# EAGLE design WMD_Board (EAGLE 9.3.0)

## Sheet 1 of 3: Power System
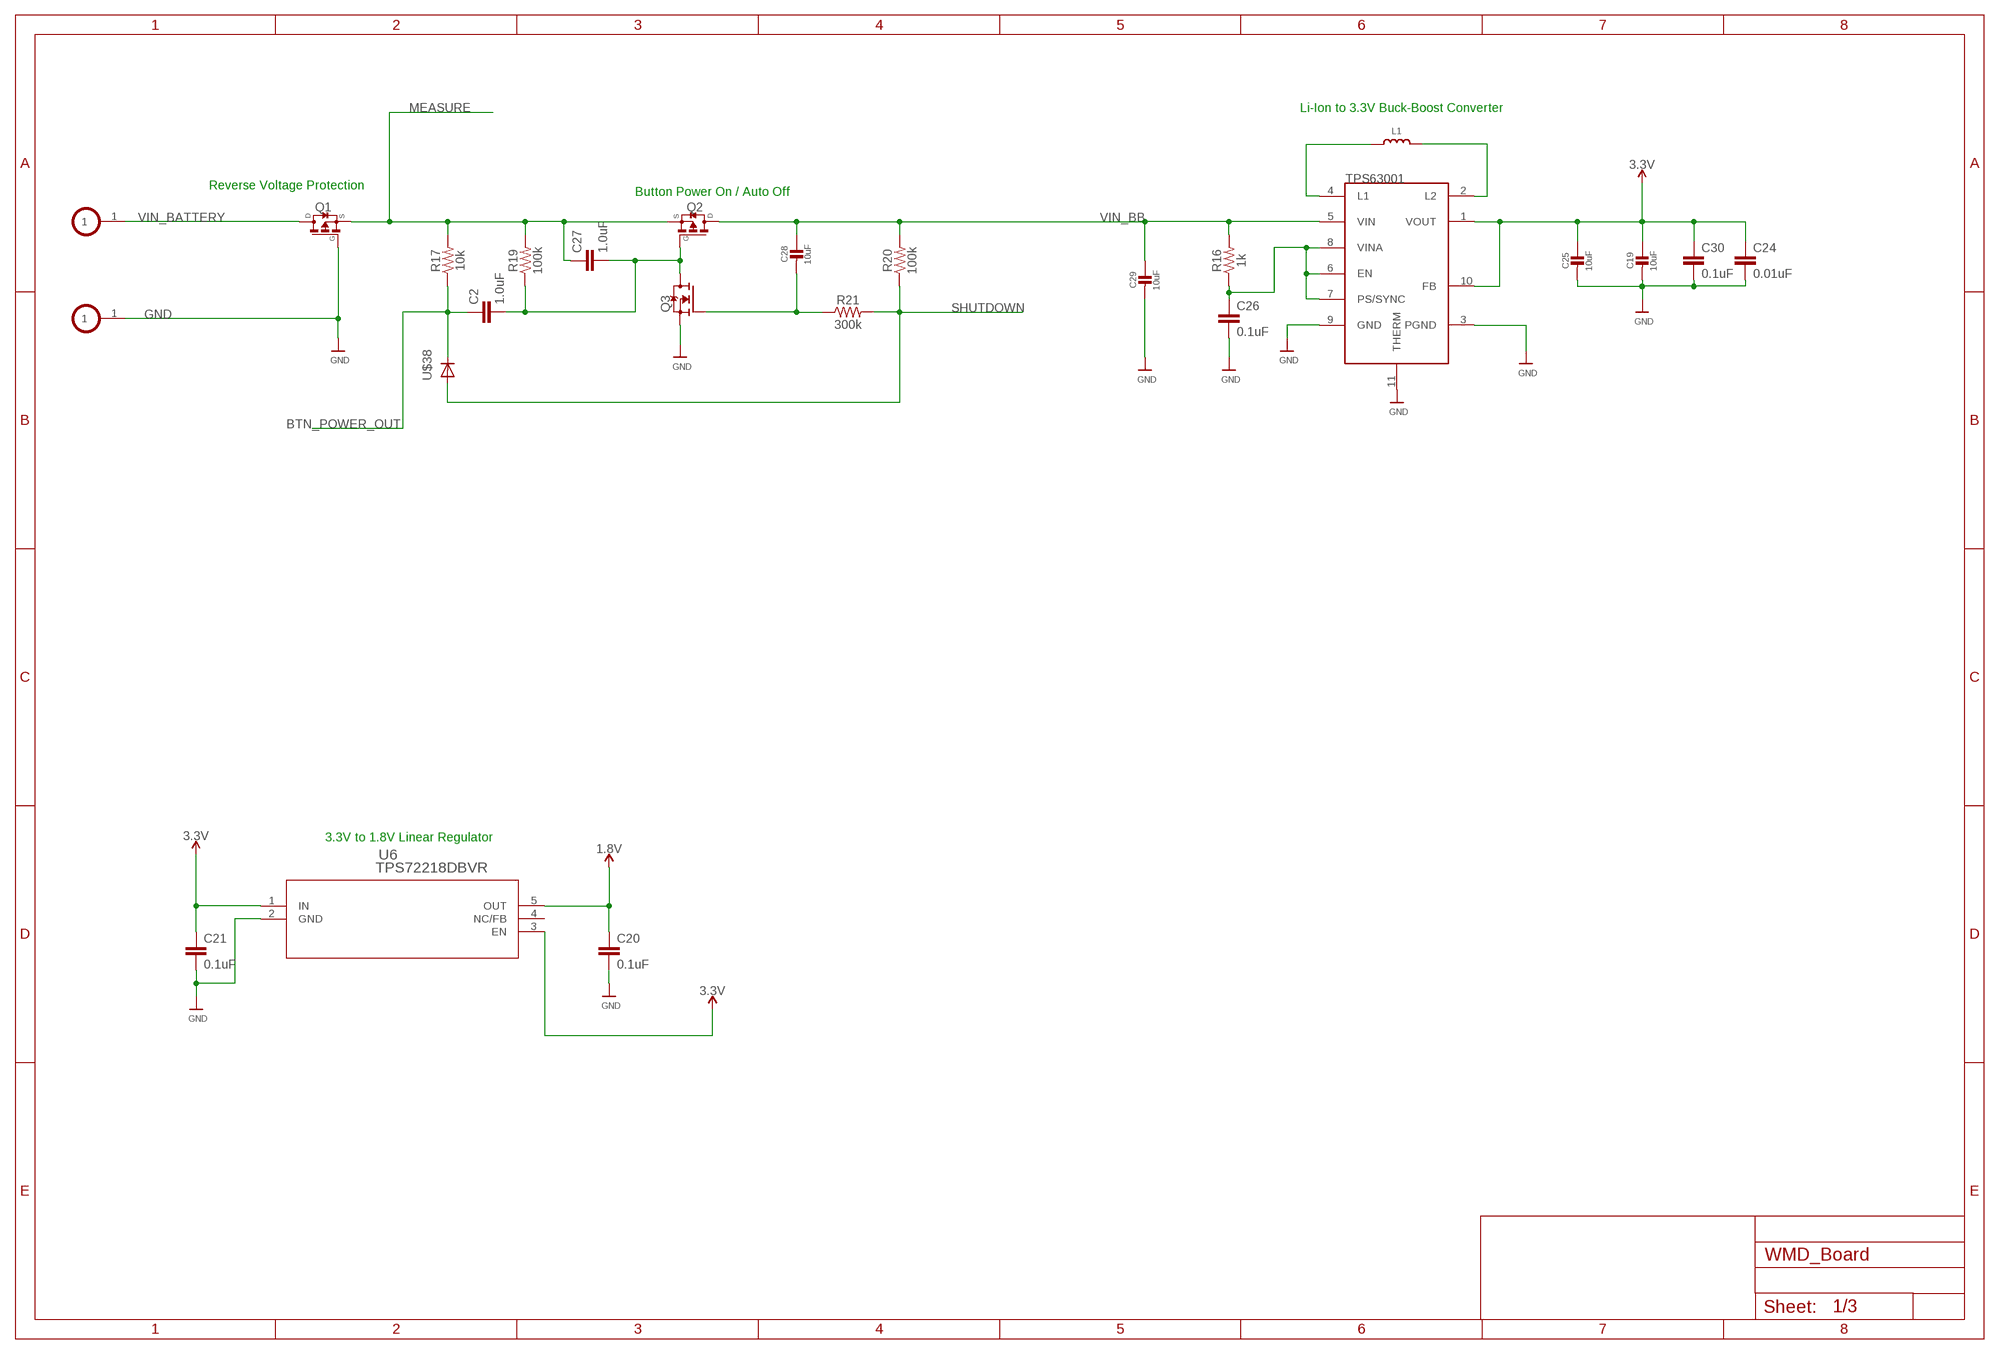
[diagram p0: schematic, sheet 1]

### Parts
C2  1.0uF  1.0UF-0603-16V-10%  [0603]
C19  10uF  CAP_CERAMIC0805-NOOUTLINE  [0805-NO]
C20  0.1uF  0.1UF-0603-25V-(+80/-20%)  [0603]
C21  0.1uF  0.1UF-0603-25V-(+80/-20%)  [0603]
C24  0.01uF  1.0UF-0603-16V-10%  [0603]
C25  10uF  CAP_CERAMIC0805-NOOUTLINE  [0805-NO]
C26  0.1uF  1.0UF-0603-16V-10%  [0603]
C27  1.0uF  1.0UF-0603-16V-10%  [0603]
C28  10uF  CAP_CERAMIC0805-NOOUTLINE  [0805-NO]
C29  10uF  CAP_CERAMIC0805-NOOUTLINE  [0805-NO]
C30  0.1uF  1.0UF-0603-16V-10%  [0603]
L1  2.2uH/NRH2412T2R2MNGH  INDUCTORNRH2412T  [INDUCTOR_TAIYOYUDEN_NRH2412T]
Q1  SI2323DS-T1-E3  [SOT23]
Q2  SI2323DS-T1-E3  [SOT23]
Q3  SI2312BDS  [SOT23]
R16  1k  1KOHM-0603-1/10W-1%  [0603]
R17  10k  1KOHM-0603-1/10W-1%  [0603]
R19  100k  1KOHM-0603-1/10W-1%  [0603]
R20  100k  1KOHM-0603-1/10W-1%  [0603]
R21  300k  1KOHM-0603-1/10W-1%  [0603]
U6  TPS72218DBVR  [DBV5]
U$22  TPS63001  [TPS63001]
U$38  TS4148C_RZG  [C0805K]
U$40  BATTERY_HOLE  [BATTERY_HOLE]
U$41  BATTERY_HOLE  [BATTERY_HOLE]

### Nets
1.8V: C20.1 U6.5(OUT) ; also sheet 2,3
3.3V: C19.1 C21.1 C24.1 C25.1 C30.1 U6.1(IN) U6.3(EN) U$22.1(VOUT) U$22.10(FB) ; also sheet 2,3
BTN_POWER_OUT: C2.1 R17.1 U$38.C ; also sheet 2
GND: C19.2 C20.2 C21.2 C24.2 C25.2 C26.2 C29.2 C30.2 Q1.1(G) Q3.2(S) U6.2(GND) U$22.3(PGND) U$22.9(GND) U$22.11(THERM) U$41.1 ; also sheet 2,3
MEASURE: C27.1 Q1.2(S) Q2.2(S) R17.2 R19.2 ; also sheet 2
N$2: L1.1 U$22.4(L1)
N$3: L1.2 U$22.2(L2)
N$7: C26.1 R16.1 U$22.6(EN) U$22.7(PS/SYNC) U$22.8(VINA)
N$13: C28.2 Q3.1(G) R21.1
N$14: C2.2 C27.2 Q2.1(G) Q3.3(D) R19.1
SHUTDOWN: R20.1 R21.2 U$38.A ; also sheet 2
VIN_BATTERY: Q1.3(D) U$40.1
VIN_BB: C28.1 C29.1 Q2.3(D) R16.2 R20.2 U$22.5(VIN)
Unconnected: U6.4(NC/FB)

### Notes on the sheet
- Li-Ion to 3.3V Buck-Boost Converter
- Reverse Voltage Protection
- Button Power On / Auto Off
- 3.3V to 1.8V Linear Regulator

## Sheet 2 of 3: Microcontroller
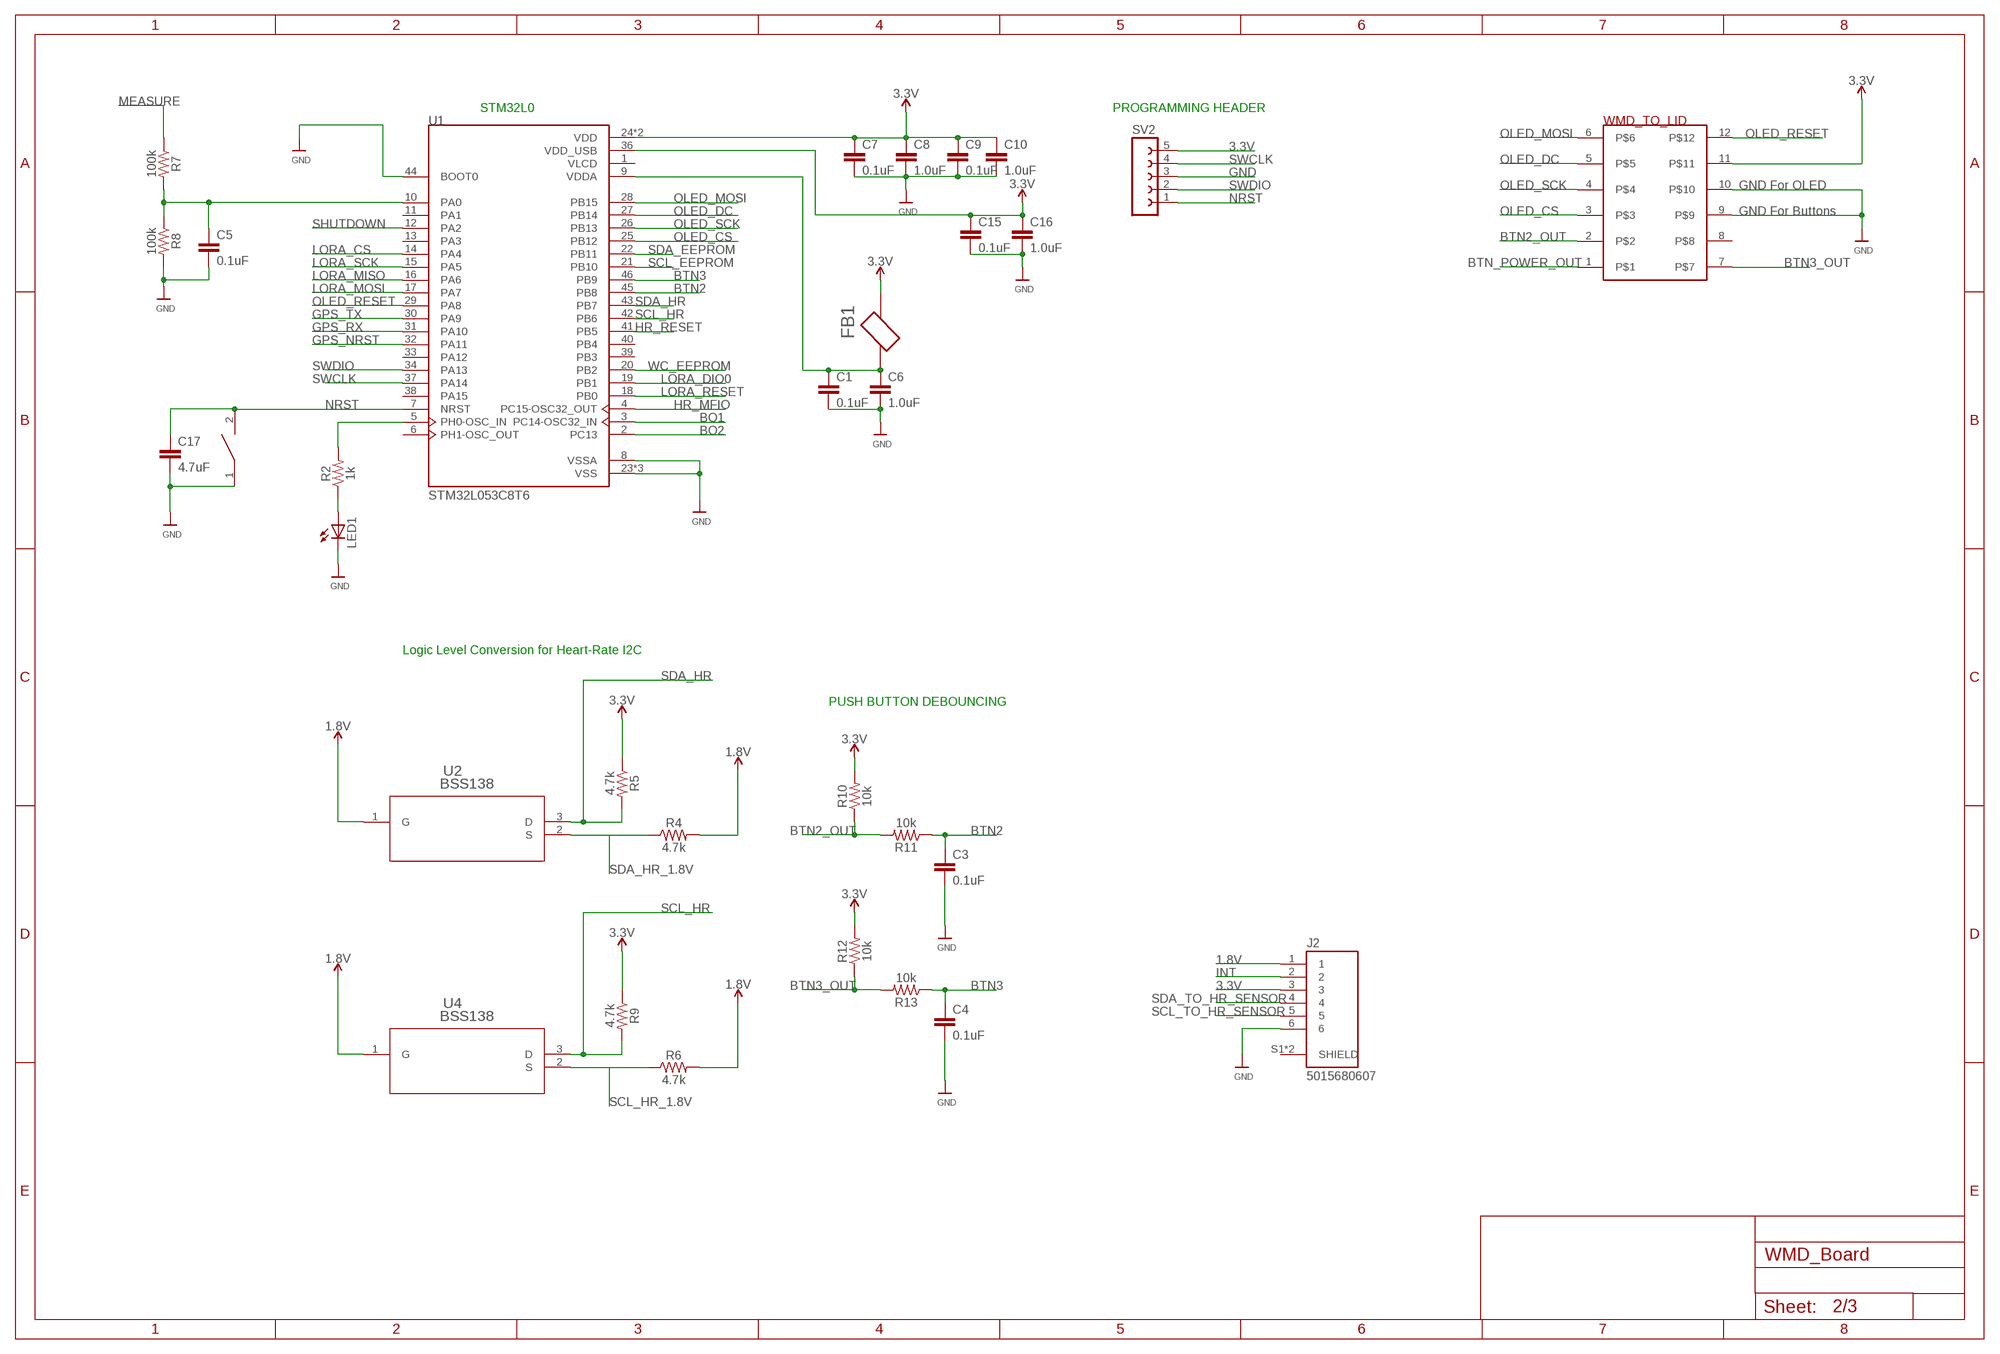
[diagram p1: schematic, sheet 2]

### Parts
C1  0.1uF  0.1UF-0603-25V-(+80/-20%)  [0603]
C3  0.1uF  0.1UF-0603-25V-(+80/-20%)  [0603]
C4  0.1uF  0.1UF-0603-25V-(+80/-20%)  [0603]
C5  0.1uF  0.1UF-0603-25V-(+80/-20%)  [0603]
C6  1.0uF  1.0UF-0603-16V-10%  [0603]
C7  0.1uF  0.1UF-0603-25V-(+80/-20%)  [0603]
C8  1.0uF  1.0UF-0603-16V-10%  [0603]
C9  0.1uF  0.1UF-0603-25V-(+80/-20%)  [0603]
C10  1.0uF  1.0UF-0603-16V-10%  [0603]
C15  0.1uF  0.1UF-0603-25V-(+80/-20%)  [0603]
C16  1.0uF  1.0UF-0603-16V-10%  [0603]
C17  4.7uF  4.7UF0603  [0603]
FB1  FERRITE_BEAD  [BEADC1608X100N]
J2  5015680607  [MOLEX_5015680607]
LED1  LEDCHIP-LED0805  [CHIP-LED0805]
R2  1k  1KOHM-0603-1/10W-1%  [0603]
R4  4.7k  1KOHM-0603-1/10W-1%  [0603]
R5  4.7k  1KOHM-0603-1/10W-1%  [0603]
R6  4.7k  1KOHM-0603-1/10W-1%  [0603]
R7  100k  1KOHM-0603-1/10W-1%  [0603]
R8  100k  1KOHM-0603-1/10W-1%  [0603]
R9  4.7k  1KOHM-0603-1/10W-1%  [0603]
R10  10k  10KOHM-0603-1/10W-1%  [0603]
R11  10k  10KOHM-0603-1/10W-1%  [0603]
R12  10k  10KOHM-0603-1/10W-1%  [0603]
R13  10k  10KOHM-0603-1/10W-1%  [0603]
RESET  SWITCH  [SW_2512]
SV2  FE05-1  [FE05-1]
U1  STM32L053C8T6  [QFP50P900X900X160-48N]
U2  BSS138  [SOT-23-3L]
U4  BSS138  [SOT-23-3L]
U$20  TS_DR_6  [TST_DR_6]

### Nets
1.8V: J2.1 R4.2 R6.2 U2.1(G) U4.1(G) ; also sheet 1,3
3.3V: C7.1 C8.1 C9.1 C10.1 C15.1 C16.1 FB1.1 J2.3 R5.1 R9.1 R10.2 R12.2 SV2.5 U1.24(VDD) U1.36(VDD_USB) U1.48(VDD) U$20.11 ; also sheet 1,3
BO1: U1.3(PC14-OSC32_IN)
BO2: U1.2(PC13)
BTN2: C3.1 R11.1 U1.45(PB8)
BTN2_OUT: R10.1 R11.2 U$20.2
BTN3: C4.1 R13.1 U1.46(PB9)
BTN3_OUT: R12.1 R13.2 U$20.7
BTN_POWER_OUT: U$20.1 ; also sheet 1
GND: C1.2 C3.2 C4.2 C5.2 C6.2 C7.2 C8.2 C9.2 C10.2 C15.2 C16.2 C17.2 J2.6 LED1.C R8.2 RESET.1 SV2.3 U1.8(VSSA) U1.23(VSS) U1.35(VSS) U1.44(BOOT0) U1.47(VSS) U$20.9 U$20.10 ; also sheet 1,3
GPS_NRST: U1.32(PA11) ; also sheet 3
GPS_RX: U1.31(PA10) ; also sheet 3
GPS_TX: U1.30(PA9) ; also sheet 3
HR_MFIO: U1.4(PC15-OSC32_OUT) ; also sheet 3
HR_RESET: U1.41(PB5) ; also sheet 3
INT: J2.2 ; also sheet 3
LORA_CS: U1.14(PA4) ; also sheet 3
LORA_DIO0: U1.19(PB1) ; also sheet 3
LORA_MISO: U1.16(PA6) ; also sheet 3
LORA_MOSI: U1.17(PA7) ; also sheet 3
LORA_RESET: U1.18(PB0) ; also sheet 3
LORA_SCK: U1.15(PA5) ; also sheet 3
MEASURE: R7.1 ; also sheet 1
N$1: LED1.A R2.1
N$4: C5.1 R7.2 R8.1 U1.10(PA0)
N$5: C1.1 C6.1 FB1.2 U1.9(VDDA)
N$12: R2.2 U1.5(PH0-OSC_IN)
NRST: C17.1 RESET.2 SV2.1 U1.7(NRST)
OLED_CS: U1.25(PB12) U$20.3
OLED_DC: U1.27(PB14) U$20.5
OLED_MOSI: U1.28(PB15) U$20.6
OLED_RESET: U1.29(PA8) U$20.12
OLED_SCK: U1.26(PB13) U$20.4
SCL_EEPROM: U1.21(PB10) ; also sheet 3
SCL_HR: R9.2 U1.42(PB6) U4.3(D)
SCL_HR_1.8V: R6.1 U4.2(S) ; also sheet 3
SCL_TO_HR_SENSOR: J2.5 ; also sheet 3
SDA_EEPROM: U1.22(PB11) ; also sheet 3
SDA_HR: R5.2 U1.43(PB7) U2.3(D)
SDA_HR_1.8V: R4.1 U2.2(S) ; also sheet 3
SDA_TO_HR_SENSOR: J2.4 ; also sheet 3
SHUTDOWN: U1.12(PA2) ; also sheet 1
SWCLK: SV2.4 U1.37(PA14)
SWDIO: SV2.2 U1.34(PA13)
WC_EEPROM: U1.20(PB2) ; also sheet 3
Unconnected: J2.S1(SHIELD) J2.S2(SHIELD) U1.1(VLCD) U1.6(PH1-OSC_OUT) U1.11(PA1) U1.13(PA3) U1.33(PA12) U1.38(PA15) U1.39(PB3) U1.40(PB4) U$20.8

### Notes on the sheet
- STM32L0 | PROGRAMMING HEADER
- GND For OLED
- GND For Buttons
- Logic Level Conversion for Heart-Rate I2C
- PUSH BUTTON DEBOUNCING

## Sheet 3 of 3: Sensors
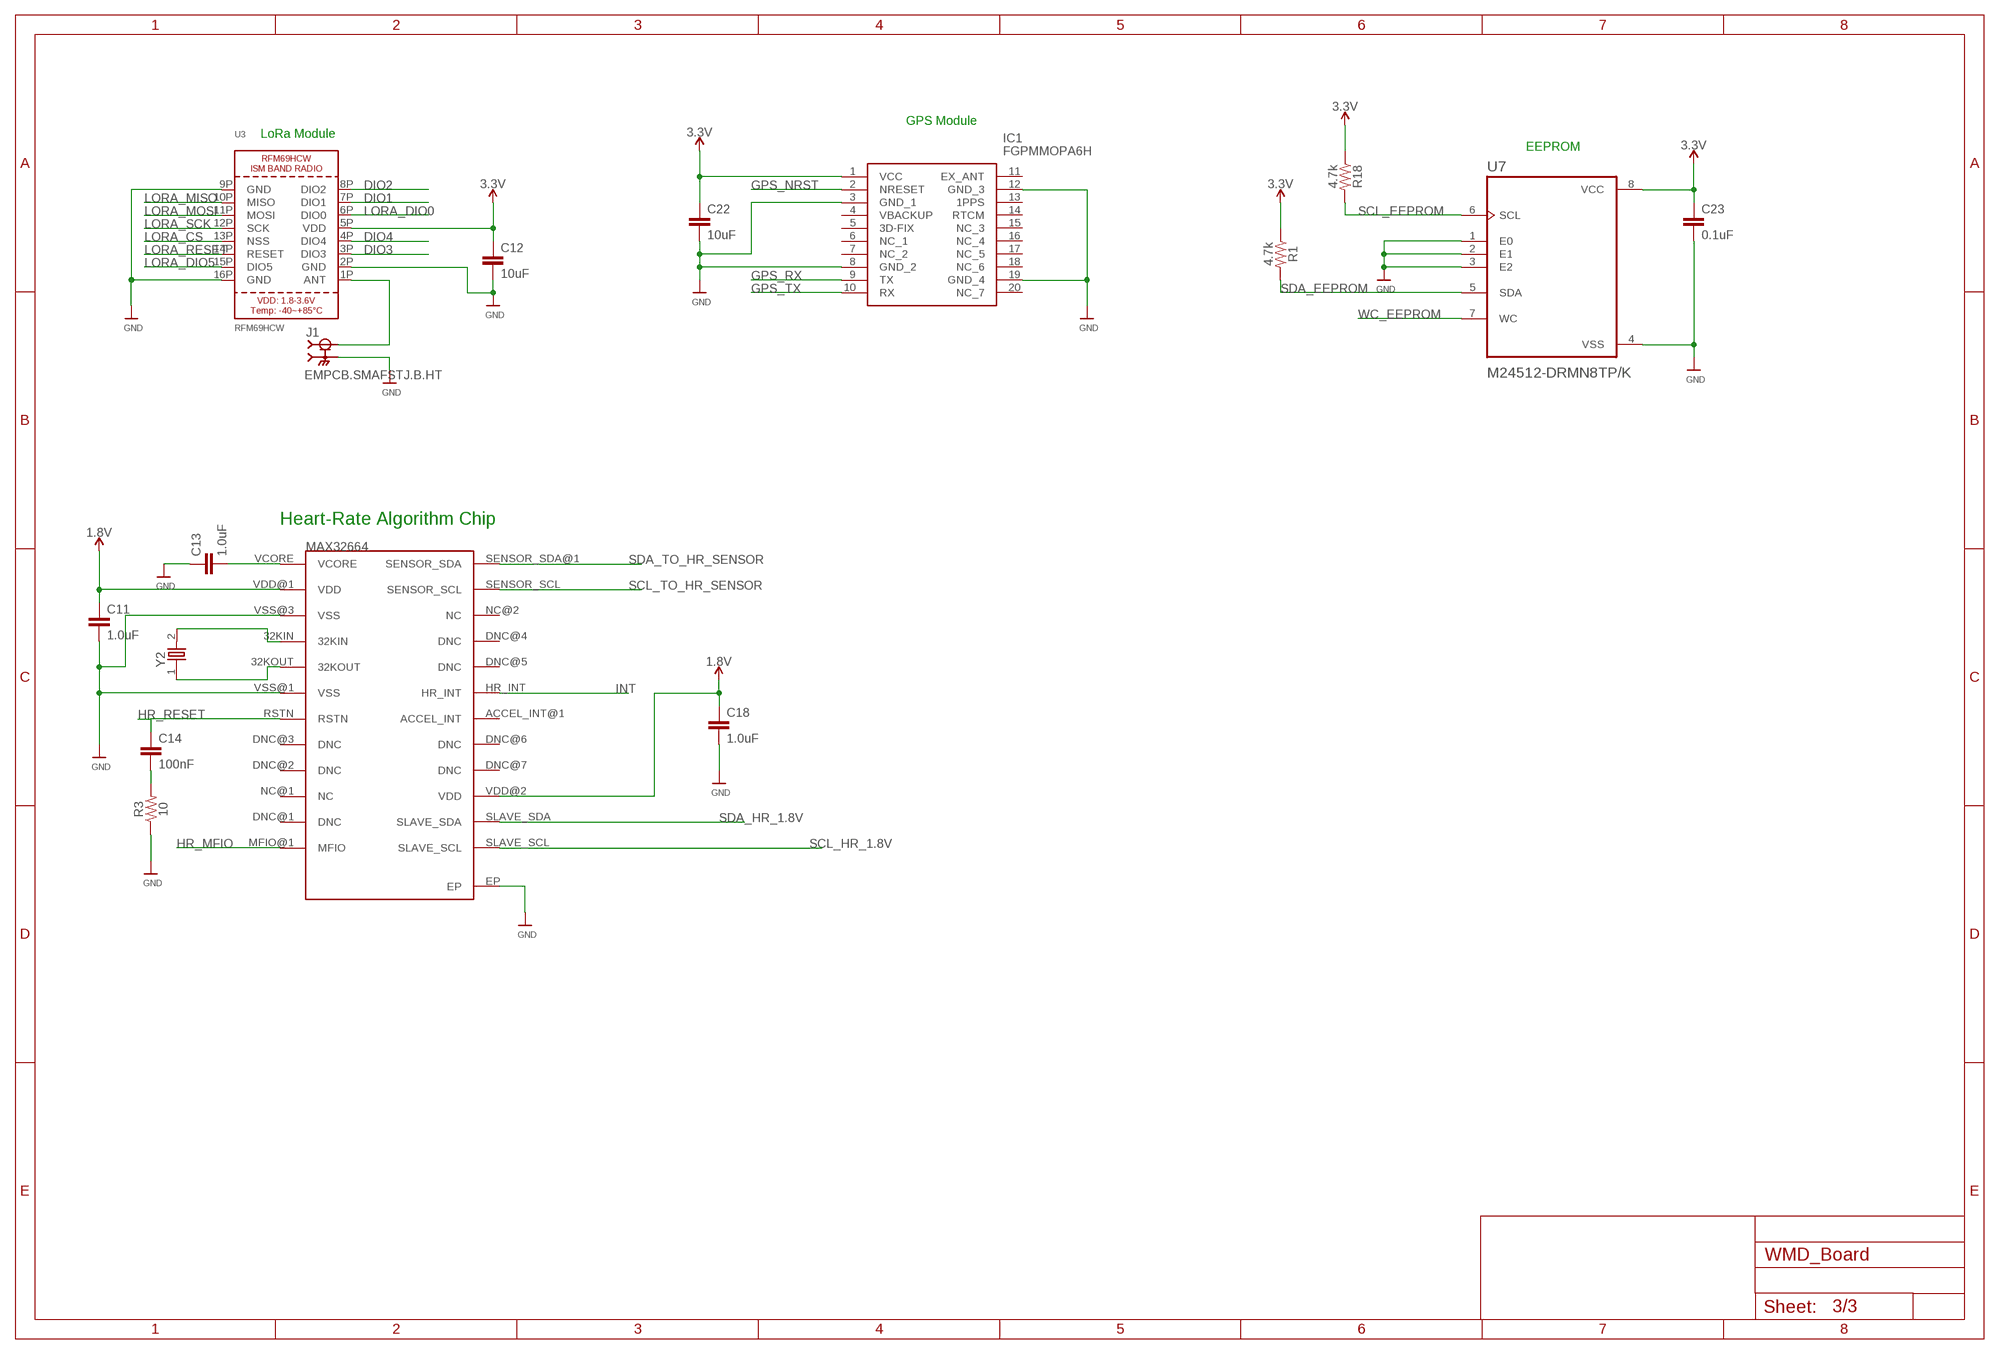
[diagram p2: schematic, sheet 3]

### Parts
C11  1.0uF  1.0UF-0603-16V-10%  [0603]
C12  10uF  10UF-0603-6.3V-20%  [0603]
C13  1.0uF  1.0UF-0603-16V-10%  [0603]
C14  100nF  1.0UF-0603-16V-10%  [0603]
C18  1.0uF  1.0UF-0603-16V-10%  [0603]
C22  10uF  10UF-0603-6.3V-20%  [0603]
C23  0.1uF  0.1UF-0603-25V-(+80/-20%)  [0603]
IC1  FGPMMOPA6H  [FGPMMOPA6H]
J1  EMPCB.SMAFSTJ.B.HT  [TAOGLAS_EMPCB.SMAFSTJ.B.HT]
R1  4.7k  1KOHM-0603-1/10W-1%  [0603]
R3  10  100KOHM-0603-1/10W-1%  [0603]
R18  4.7k  1KOHM-0603-1/10W-1%  [0603]
U3  RFM69HCW  RFM69HCW_SMT  [RFMHCW_SMT]
U7  M24512-DRMN8TP/K  [SOIC127P600X175-8N]
U$10  MAX32664_TQFN  [MAX32664]
Y2  ABS06-107-32.768KHZ-T  [XTAL_ABS06-107-32.768KHZ-T]

### Nets
1.8V: C11.1 C18.1 U$10.VDD@1(VDD) U$10.VDD@2(VDD) ; also sheet 1,2
3.3V: C12.1 C22.1 C23.1 IC1.1(VCC) R1.1 R18.1 U3.5P(VDD) U7.8(VCC) ; also sheet 1,2
DIO1: U3.7P(DIO1)
DIO2: U3.8P(DIO2)
DIO3: U3.3P(DIO3)
DIO4: U3.4P(DIO4)
GND: C11.2 C12.2 C13.1 C18.2 C22.2 C23.2 IC1.3(GND_1) IC1.8(GND_2) IC1.12(GND_3) IC1.19(GND_4) J1.SH1 J1.SH2 J1.SH3 J1.SH4 R3.1 U3.2P(GND) U3.9P(GND) U3.16P(GND) U7.1(E0) U7.2(E1) U7.3(E2) U7.4(VSS) U$10.EP U$10.VSS@1(VSS) U$10.VSS@3(VSS) ; also sheet 1,2
GPS_NRST: IC1.2(NRESET) ; also sheet 2
GPS_RX: IC1.9(TX) ; also sheet 2
GPS_TX: IC1.10(RX) ; also sheet 2
HR_MFIO: U$10.MFIO@1(MFIO) ; also sheet 2
HR_RESET: C14.1 U$10.RSTN ; also sheet 2
INT: U$10.HR_INT ; also sheet 2
LORA_CS: U3.13P(NSS) ; also sheet 2
LORA_DIO0: U3.6P(DIO0) ; also sheet 2
LORA_DIO5: U3.15P(DIO5)
LORA_MISO: U3.10P(MISO) ; also sheet 2
LORA_MOSI: U3.11P(MOSI) ; also sheet 2
LORA_RESET: U3.14P(RESET) ; also sheet 2
LORA_SCK: U3.12P(SCK) ; also sheet 2
N$6: C13.2 U$10.VCORE
N$8: J1.1 U3.1P(ANT)
N$9: C14.2 R3.2
N$10: U$10.32KIN Y2.2
N$11: U$10.32KOUT Y2.1
SCL_EEPROM: R18.2 U7.6(SCL) ; also sheet 2
SCL_HR_1.8V: U$10.SLAVE_SCL ; also sheet 2
SCL_TO_HR_SENSOR: U$10.SENSOR_SCL ; also sheet 2
SDA_EEPROM: R1.2 U7.5(SDA) ; also sheet 2
SDA_HR_1.8V: U$10.SLAVE_SDA ; also sheet 2
SDA_TO_HR_SENSOR: U$10.SENSOR_SDA@1(SENSOR_SDA) ; also sheet 2
WC_EEPROM: U7.7(WC) ; also sheet 2
Unconnected: IC1.4(VBACKUP) IC1.5(3D-FIX) IC1.6(NC_1) IC1.7(NC_2) IC1.11(EX_ANT) IC1.13(1PPS) IC1.14(RTCM) IC1.15(NC_3) IC1.16(NC_4) IC1.17(NC_5) IC1.18(NC_6) IC1.20(NC_7) U$10.ACCEL_INT@1(ACCEL_INT) U$10.DNC@1(DNC) U$10.DNC@2(DNC) U$10.DNC@3(DNC) U$10.DNC@4(DNC) U$10.DNC@5(DNC) U$10.DNC@6(DNC) U$10.DNC@7(DNC) U$10.NC@1(NC) U$10.NC@2(NC)

### Notes on the sheet
- GPS Module
- LoRa Module
- EEPROM
- Heart-Rate Algorithm Chip

## Library data of the parts
C1 C3-C5 C7 C9 C15 C20 C21 C23 = SparkFun-Capacitors:0.1UF: 0.1µF ceramic capacitors A capacitor is a passive two-terminal electrical component used to store electrical energy temporarily in an electric field.; PROD_ID: CAP-00810
C2 C6 C8 C10 C11 C13 C16 C18 C27 = SparkFun-Capacitors:1.0UF: 1µF ceramic capacitors A capacitor is a passive two-terminal electrical component used to store electrical energy temporarily in an electric field.; PROD_ID: CAP-00868
C12 C22 = SparkFun-Capacitors:10UF: 10.0µF ceramic capacitors A capacitor is a passive two-terminal electrical component used to store electrical energy temporarily in an electric field.; PROD_ID: CAP-11015
C14 C24 C26 C30 = SparkFun-Capacitors:1.0UF: 1µF ceramic capacitors A capacitor is a passive two-terminal electrical component used to store electrical energy temporarily in an electric field.; PROD_ID: CAP-00868; VALUE: 1.0uF
C17 = SparkFun-Capacitors:4.7UF: 4.7µF ceramic capacitors A capacitor is a passive two-terminal electrical component used to store electrical energy temporarily in an electric field.; PROD_ID: CAP-08280
C19 C25 C28 C29 = microbuilder:CAP_CERAMIC: Ceramic Capacitors For new designs, use the packages preceded by an '_' character since they are more reliable: The following footprints should be used on most boards: _0402 - Standard footprint for regular board layouts _0603 - Standard footprint for regular board layouts _0805 - Standard footprint for regular board layouts _1206 - Standard footprint for regular board layouts For extremely tight-pitch boards where space is at a premium, the following 'micro-pitch' footprints can be used (smaller pads, no silkscreen outline, etc.): _0402MP - Micro-pitch footprint for very dense/compact boards _0603MP - Micro-pitch footprint for very dense/compact boards _0805MP - Micro-pitch footprint for very dense/compact boards _1206MP - Micro-pitch footprint for very dense/compact boards
FB1 = Ferrite_Bead:FERRITE_BEAD: Ferrite Beads Power Chip 18Ohm 30% 100MHz 7.5A 4mOhm DCR 0603 Automotive T/R; DESCRIPTION: 18 Ohms @ 100MHz 1 Power Line Ferrite Bead 0603 _1608 Metric_ 7.5A 4mOhm; DIGI-KEY_PART_NUMBER: 587-3251-1-ND; DIGI-KEY_PURCHASE_URL: https://www.digikey.com/product-detail/en/abb-power-electronics-inc-va/FBMJ1608HM180NTR/587-3251-1-ND/3662204?utm_source=snapeda&utm_medium=aggregator&utm_campaign=symbol; MF: Taiyo Yuden; MP: FBMJ1608HM180NTR; PACKAGE: 1608 Taiyo Yuden
IC1 = FGPMMOPA6H:FGPMMOPA6H: GPS Standalone Module, 20-pin Source: Datasheet <https://cdn-shop.adafruit.com/datasheets/GlobalTop-FGPMMOPA6H-Datasheet-V0A.pdf>; DESCRIPTION: GPS Standalone Module, 20-pin; HEIGHT: mm; MANUFACTURER_NAME: GlobalTop Technology Inc.; MANUFACTURER_PART_NUMBER: FGPMMOPA6H
J1 = EMPCB.SMAFSTJ.B.HT:EMPCB.SMAFSTJ.B.HT: Conn SMA F 0Hz to 12.4GHz 50Ohm Solder ST Edge Mount Gold; DESCRIPTION: SMA Connector Jack, Female Socket 50Ohm Board Edge, End Launch Solder; DIGI-KEY_PART_NUMBER: 931-1175-ND; DIGI-KEY_PURCHASE_URL: https://www.digikey.com/product-detail/en/taoglas-limited/EMPCB.SMAFSTJ.B.HT/931-1175-ND/3522337?utm_source=snapeda&utm_medium=aggregator&utm_campaign=symbol; MF: Taoglas Limited; MP: EMPCB.SMAFSTJ.B.HT; PACKAGE: None
J2 = WMD_TO_HRF:5015680607: 1.00mm Pitch Pico-Clasp™ Wire-to-Board Header, Surface Mount, Single Row, Right Angle, with Positive Lock, 6 Circuits; DESCRIPTION: Connector Header Surface Mount, Right Angle 6 position 0.039 _1.00mm_; DIGI-KEY_PART_NUMBER: WM7897CT-ND; DIGI-KEY_PURCHASE_URL: https://www.digikey.com/product-detail/en/molex/5015680607/WM7897CT-ND/1531547?utm_source=snapeda&utm_medium=aggregator&utm_campaign=symbol; MF: Molex; MP: 5015680607; PACKAGE: None
L1 = microbuilder:INDUCTOR: Inductors 0603: 10nH Ceramic Inductor - microwire antenna/RF (Digikey: 712-1434-2-ND) 0805: 560nH Ceramic Inductor - RF (Digikey: 553-1047-1-ND) 270nH Ceramic Inductor - Q = 40@250MHz, +-5%, 1 Ohm DC Resistance (Digikey: 535-10506-2-ND) 1007 (2518 Metric) SMT: 10µH 10% 250mOhm 820mA 1007 Inductor (Digikey: 587-2189-1-ND) 22µH 10% 500mOhm 580mA 1007 Inductor (Digikey: 587-2190-1-ND) 47µH 10% 950mOhm 420mA 1007 Inductor (Digikey: 587-2191-1-ND) 47µH 5% 100mOhm 1A 1008 Inductor (Digikey: 732-1816-1-ND) 5.0x5.0mm (Taiyo Yuden NR5040 Series) 6.8µH 20% 2.3A 64mOhm Inductor (Digikey: 587-2374-2-ND) 5.0x5.0mm (TDK VLC5045 Series) 4.7µH 20% 3.3A 34mOhm Inductor (Digikey: 445-6526-1-ND) 6.8µH 20% 2.7A 46mOhm Inductor (Digikey: 445-6527-1-ND) 6.0x6.0mm (TDK VLC6045 Series) 4.7µH 20% 3.8A 27mOhm Inductor (Digikey: 445-6538-2-ND) 6.8µH 20% 3A 41mOhm Inductor (Digikey: 445-6540-1-ND) 6.2µH 30% 2.2A 45mOhm Inductor (Digikey: SRR5028-6R2YCT-ND) - Not TDK VLC6045 but footprint should match 6.0x6.0mm (TDK SLF6045 Series) 6.8uH 30% 2A 33mOhm Inductor (Digikey: 445-4572-1-ND, Mouser: 810-SLF645T6R8N2R0PF) 6.0x6.0mm (Sumida CDRH5D28 Series) 6.2uH 30% 1.8A 45mOhm Inductor (Digikey: 308-1542-1-ND) Taiyo Yuden NR3015T2R2M - 2.2uH 20% 1.5A (Digikey: 587-1648-2-ND, Mouser: 963-NR3015T2R2M) - Used with TI TPS62172 CoilCraft RFID Transponder Coil - MA5532-AE (For use with AS3935 Lightning Sensor) Taiyo Yuden NRH2412T2R2MNGH - 2.2uH 20% 1AA (Digikey: 587-3443-1-ND) - Used with TI LM3671 Vishay IHLP 1.0uH Molded Inductor - 24mOhm DCR, 5A, +/-20%, -55°C-125°C (Digikey: 541-1319-1-ND)
LED1 = led:LED: LED OSRAM: - CHIPLED LG R971, LG N971, LY N971, LG Q971, LY Q971, LO R971, LY R971 LH N974, LH R974 LS Q976, LO Q976, LY Q976 LO Q996 - Hyper CHIPLED LW Q18S LB Q993, LB Q99A, LB R99A - SideLED LS A670, LO A670, LY A670, LG A670, LP A670 LB A673, LV A673, LT A673, LW A673 LH A674 LY A675 LS A676, LA A676, LO A676, LY A676, LW A676 LS A679, LY A679, LG A679 - Hyper Micro SIDELED® LS Y876, LA Y876, LO Y876, LY Y876 LT Y87S - SmartLED LW L88C, LW L88S LB L89C, LB L89S, LG L890 LS L89K, LO L89K, LY L89K LS L896, LA L896, LO L896, LY L896 - TOPLED LS T670, LO T670, LY T670, LG T670, LP T670 LSG T670, LSP T670, LSY T670, LOP T670, LYG T670 LG T671, LOG T671, LSG T671 LB T673, LV T673, LT T673, LW T673 LH T674 LS T676, LA T676, LO T676, LY T676, LB T676, LH T676, LSB T676, LW T676 LB T67C, LV T67C, LT T67C, LS T67K, LO T67K, LY T67K, LW E67C LS E67B, LA E67B, LO E67B, LY E67B, LB E67C, LV E67C, LT E67C LW T67C LS T679, LY T679, LG T679 LS T770, LO T770, LY T770, LG T770, LP T770 LB T773, LV T773, LT T773, LW T773 LH T774 LS E675, LA E675, LY E675, LS T675 LS T776, LA T776, LO T776, LY T776, LB T776 LHGB T686 LT T68C, LB T68C - Hyper Mini TOPLED® LB M676 - Mini TOPLED Santana® LG M470 LS M47K, LO M47K, LY M47K Source: http://www.osram.convergy.de LUXEON: - LUMILED® LXK2-PW12-R00, LXK2-PW12-S00, LXK2-PW14-U00, LXK2-PW14-V00 LXK2-PM12-R00, LXK2-PM12-S00, LXK2-PM14-U00 LXK2-PE12-Q00, LXK2-PE12-R00, LXK2-PE12-S00, LXK2-PE14-T00, LXK2-PE14-U00 LXK2-PB12-K00, LXK2-PB12-L00, LXK2-PB12-M00, LXK2-PB14-N00, LXK2-PB14-P00, LXK2-PB14-Q00 LXK2-PR12-L00, LXK2-PR12-M00, LXK2-PR14-Q00, LXK2-PR14-R00 LXK2-PD12-Q00, LXK2-PD12-R00, LXK2-PD12-S00 LXK2-PH12-R00, LXK2-PH12-S00 LXK2-PL12-P00, LXK2-PL12-Q00, LXK2-PL12-R00 Source: www.luxeon.com KINGBRIGHT: KA-3528ASYC Source: www.kingbright.com; SPICEPREFIX: L
Q1 Q2 = SI2323DS-T1-E3:SI2323DS-T1-E3: P-Channel MOSFET; AVAILABILITY: Unavailable; DESCRIPTION: P-Channel 20V 3.7A _Ta_ 750mW _Ta_ Surface Mount SOT-23-3 _TO-236_; MF: Vishay Siliconix; MP: SI2323DS-T1-E3; PACKAGE: SOT-23-3 Vishay; PRICE: None
Q3 = SI2312BDS:SI2312BDS; DESCRIPTION: RoHS Compliant | Industry-leading quality | Fast Switching | Low Profile _less than 1.1mm_ | SOT-23 Footprint; DIGI-KEY_PART_NUMBER: IRLML2502TRPBFCT-ND; DIGI-KEY_PURCHASE_URL: https://www.digikey.com/product-detail/en/infineon-technologies/IRLML2502TRPBF/IRLML2502TRPBFCT-ND/812502?utm_source=snapeda&utm_medium=aggregator&utm_campaign=symbol; MF: Infineon; MP: IRLML2502TRPBF; PACKAGE: SOT-23-3 Infineon
R1 R4-R9 R17-R21 = SparkFun-Resistors:1KOHM: 1kΩ resistor A resistor is a passive two-terminal electrical component that implements electrical resistance as a circuit element. Resistors act to reduce current flow, and, at the same time, act to lower voltage levels within circuits. - Wikipedia; PROD_ID: RES-07856; VALUE: 1k
R2 R16 = SparkFun-Resistors:1KOHM: 1kΩ resistor A resistor is a passive two-terminal electrical component that implements electrical resistance as a circuit element. Resistors act to reduce current flow, and, at the same time, act to lower voltage levels within circuits. - Wikipedia; PROD_ID: RES-07856
R3 = SparkFun-Resistors:100KOHM: 100kΩ resistor A resistor is a passive two-terminal electrical component that implements electrical resistance as a circuit element. Resistors act to reduce current flow, and, at the same time, act to lower voltage levels within circuits. - Wikipedia; PROD_ID: RES-07828; VALUE: 100k
R10-R13 = SparkFun-Resistors:10KOHM: 10kΩ resistor A resistor is a passive two-terminal electrical component that implements electrical resistance as a circuit element. Resistors act to reduce current flow, and, at the same time, act to lower voltage levels within circuits. - Wikipedia; PROD_ID: RES-00824
RESET = DiscreteComponents:SWITCH
SV2 = con-lsta:FE05-1: FEMALE HEADER; OC_FARNELL: unknown; OC_NEWARK: unknown
U1 = STM32L053C8T6:STM32L053C8T6: Ultra-low-power ARM Cortex-M0+ MCU with 64 Kbytes Flash, 32 MHz CPU, USB, LCD; DESCRIPTION: ARM® Cortex®-M0+ STM32L0 Microcontroller IC 32-Bit 32MHz 64KB _64K x 8_ FLASH 48-LQFP _7x7_; DIGI-KEY_PART_NUMBER: 497-14906-ND; DIGI-KEY_PURCHASE_URL: https://www.digikey.com/product-detail/en/stmicroelectronics/STM32L053C8T6/497-14906-ND/4935255?utm_source=snapeda&utm_medium=aggregator&utm_campaign=symbol; MF: STMicroelectronics; MP: STM32L053C8T6; PACKAGE: LQFP-48 STMicroelectronics
U2 U4 = BSS138:BSS138; MANUFACTURER_PART_NUMBER: BSS138; VENDOR: Fairchild Semiconductor
U3 = microbuilder:RFM69HCW: RFM69HCW - ISM Band RF Transceiver
U6 = TPS72218DBVR_LDO:TPS72218DBVR; BUILT_BY: EMA_UL_Team; MANUFACTURER: Texas Instruments; MANUFACTURER_PART_NUMBER: TPS72218DBVR; VENDOR: Texas Instruments
U7 = M24512_EEPROM:M24512-DRMN8TP/K: None; AVAILABILITY: Unavailable; DESCRIPTION: EEPROM Memory IC 512Kb _64K x 8_ I²C 1MHz 450ns 8-SO; MF: STMicroelectronics; MP: M24512-DRMN8TP/K; PACKAGE: SOIC-8 STMicroelectronics; PRICE: None
U$10 = MAX32664:MAX32664_TQFN
U$20 = TST_Connnector:TS_DR_6
U$22 = TPS63001:TPS63001
U$38 = TS4148_RY:TS4148C_RZG: Standard Diode 100v, 0,5A; AVAILABILITY: Unavailable; DESCRIPTION: Diode Standard 75V 150mA Surface Mount 0603; MF: Taiwan Semiconductor; MP: TS4148 RY; PACKAGE: 0805 Taiwan Semiconductor; PRICE: None
U$40 U$41 = Battery_Hole:BATTERY_HOLE
Y2 = ABS06-107-32.768KHZ-T:ABS06-107-32.768KHZ-T: ABS06 Series 32.768 kHz ±10 ppm 12.5 pF -40 to +85 °C SMT Low Profile Crystal; DESCRIPTION: 32.768kHz ±20ppm Crystal 4pF 60 kOhms 2-SMD, No Lead; DIGI-KEY_PART_NUMBER: 535-12373-1-ND; DIGI-KEY_PURCHASE_URL: https://www.digikey.com/product-detail/en/abracon-llc/ABS06-107-32.768KHZ-T/535-12373-1-ND/4291563?utm_source=snapeda&utm_medium=aggregator&utm_campaign=symbol; MF: Abracon; MP: ABS06-107-32.768KHZ-T; PACKAGE: SMD-2 Abracon

## Board
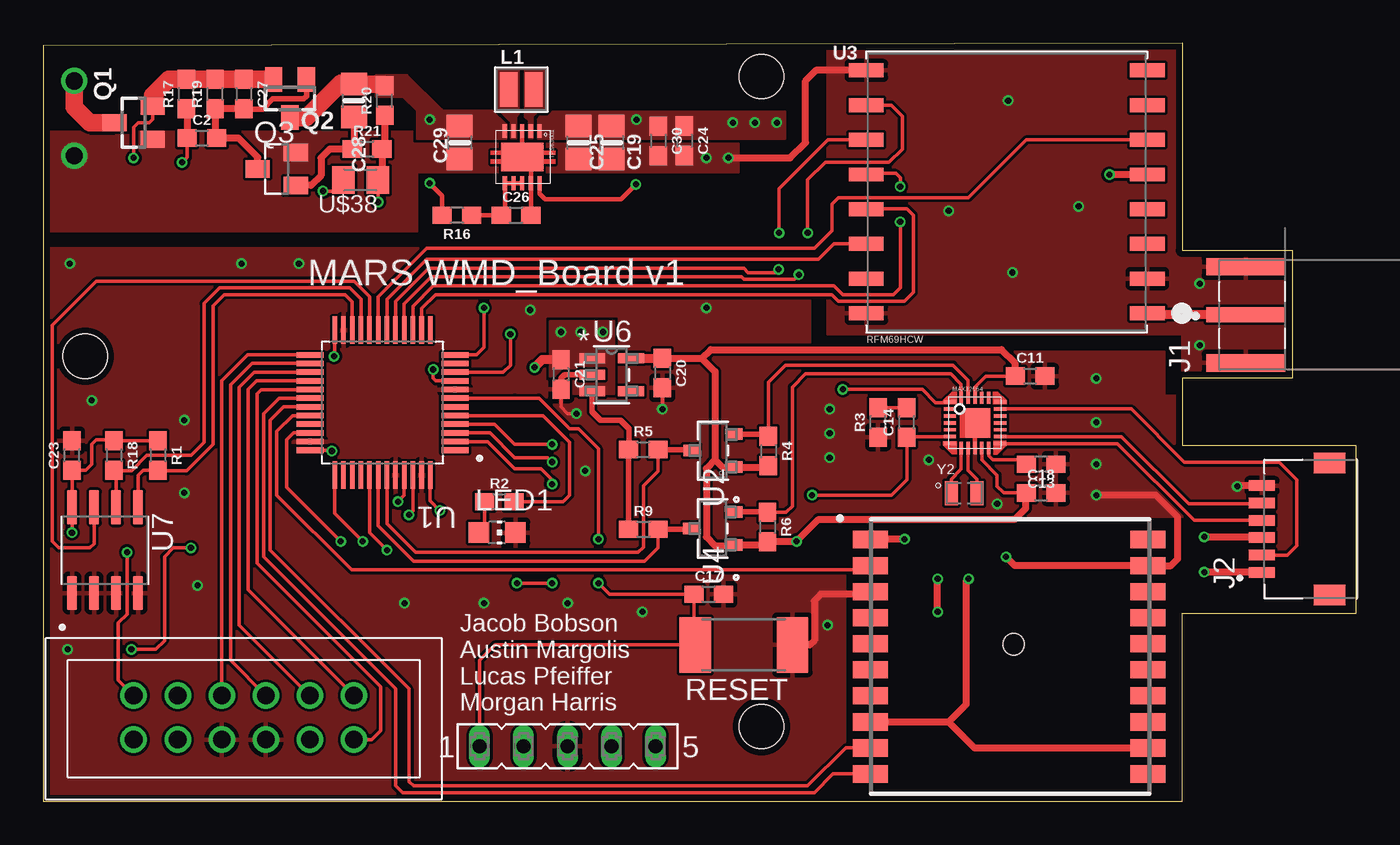
[diagram p3: board, top side]
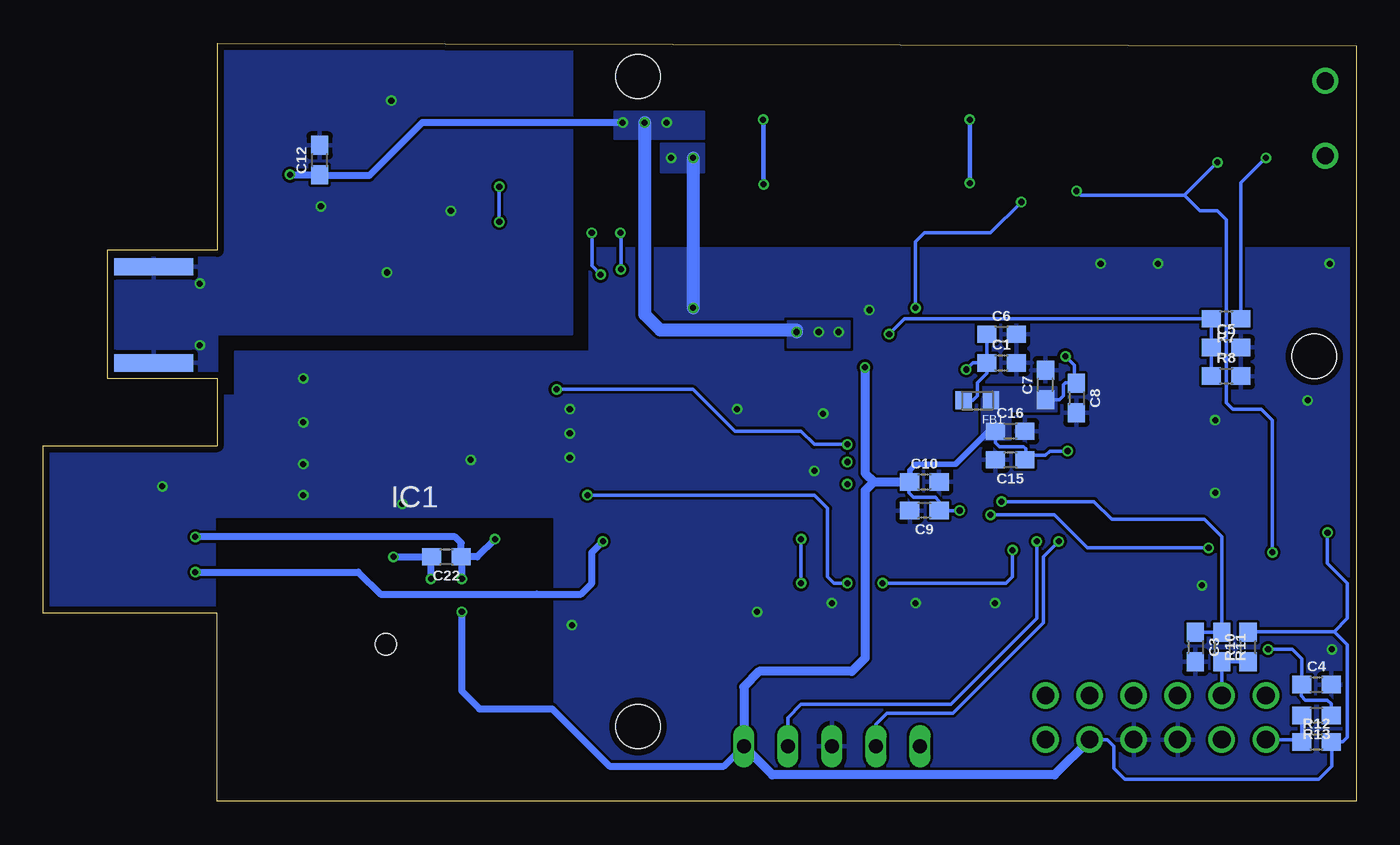
[diagram p4: board, bottom side, seen from below]

Size 75.69 x 43.69 mm. Coordinates in mm from the lower left corner, seen from the top.
Outline: 65.66,43.69 0,43.56 0,0 65.66,0 65.66,10.85 75.69,10.85 75.69,20.5 65.66,20.5 65.66,24.38 72.01,24.38 72.01,31.75 65.66,31.75 65.66,43.69
Copper layers (1*16): Top 0.035559375mm / dielectric 1.6mm / Bottom 0.035559375mm
Design rules "OSH": minimum track width 6mil, minimum drill 10mil, track to track 6mil, track to pad 6mil, pad to pad 6mil, via to via 6mil, smd to smd 6mil, copper to edge 15mil, drill to drill 6mil, minimum pad ring 5mil, minimum via ring 5mil, stop-mask expansion 2.5mil, vias tented up to drill 0mil, thermal gap 10mil
Holes 2.54 mm at 41.4,41.78 2.41,25.65 41.4,4.32

### Footprints (pad centres in the part's own frame; a part is rotated, then mirrored left to right if it is on the bottom)
0603 = smd 1.1 x 1: 1 -0.85,0; 2 0.85,0
0805-NO = smd 1.3 x 1.5: 1 -0.95,0; 2 0.95,0
BEADC1608X100N = smd 0.94 x 1.02: 1 -0.79,0; 2 0.79,0
FGPMMOPA6H = smd 2 x 1: 1 -16.07,-1.172; 2 -16.07,-2.672; 3 -16.07,-4.172; 4 -16.07,-5.672; 5 -16.07,-7.172; 6 -16.07,-8.672; 7 -16.07,-10.172; 8 -16.07,-11.672; 9 -16.07,-13.172; 10 -16.07,-14.672; 11 -0.07,-14.672; 12 -0.07,-13.172; 13 -0.07,-11.672; 14 -0.07,-10.172; 15 -0.07,-8.672; 16 -0.07,-7.172; 17 -0.07,-5.672; 18 -0.07,-4.172; 19 -0.07,-2.672; 20 -0.07,-1.172 | hole 1.2: -7.8,-7.2
TAOGLAS_EMPCB.SMAFSTJ.B.HT = smd 0.85 x 4.56: 1 0,0 | smd 1 x 4.56: SH1 -2.77,0; SH2 2.77,0 | smd 1 x 4.56 bottom: SH3 -2.77,0; SH4 2.77,0
MOLEX_5015680607 = smd 0.6 x 1.5: 1 -2.5,0; 2 -1.5,0; 3 -0.5,0; 4 0.5,0; 5 1.5,0; 6 2.5,0 | smd 1.2 x 1.8: S1 3.8,-3.9; S2 -3.8,-3.9
INDUCTOR_TAIYOYUDEN_NRH2412T = smd 1 x 2: 1 -0.725,0; 2 0.725,0
CHIP-LED0805 = smd 1.2 x 1.2: A 0,-1.05; C 0,1.05
SOT23 = smd 1 x 1.4: 1 -0.95,-1.1; 2 0.95,-1.1; 3 0,1.1
SW_2512 = smd 1.8 x 3.2: 1 -2.8,0; 2 2.8,0
FE05-1 = drill 0.813 long: 1 -5.08,0; 2 -2.54,0; 3 0,0; 4 2.54,0; 5 5.08,0
QFP50P900X900X160-48N = smd 1.56 x 0.28: 1 -4.18,2.75; 2 -4.18,2.25; 3 -4.18,1.75; 4 -4.18,1.25; 5 -4.18,0.75; 6 -4.18,0.25; 7 -4.18,-0.25; 8 -4.18,-0.75; 9 -4.18,-1.25; 10 -4.18,-1.75; 11 -4.18,-2.25; 12 -4.18,-2.75; 25 4.18,-2.75; 26 4.18,-2.25; 27 4.18,-1.75; 28 4.18,-1.25; 29 4.18,-0.75; 30 4.18,-0.25; 31 4.18,0.25; 32 4.18,0.75; 33 4.18,1.25; 34 4.18,1.75; 35 4.18,2.25; 36 4.18,2.75 | smd 0.28 x 1.56: 13 -2.75,-4.18; 14 -2.25,-4.18; 15 -1.75,-4.18; 16 -1.25,-4.18; 17 -0.75,-4.18; 18 -0.25,-4.18; 19 0.25,-4.18; 20 0.75,-4.18; 21 1.25,-4.18; 22 1.75,-4.18; 23 2.25,-4.18; 24 2.75,-4.18; 37 2.75,4.18; 38 2.25,4.18; 39 1.75,4.18; 40 1.25,4.18; 41 0.75,4.18; 42 0.25,4.18; 43 -0.25,4.18; 44 -0.75,4.18; 45 -1.25,4.18; 46 -1.75,4.18; 47 -2.25,4.18; 48 -2.75,4.18
SOT-23-3L = smd 0.66 x 0.914: 1 -0.95,-1.245; 2 0.95,-1.245; 3 0,1.245
RFMHCW_SMT = smd 2 x 0.8: 1P 8.1,-7; 2P 8.1,-5; 3P 8.1,-3; 4P 8.1,-1; 5P 8.1,1; 6P 8.1,3; 7P 8.1,5; 8P 8.1,7; 9P -8.1,7; 10P -8.1,5; 11P -8.1,3; 12P -8.1,1; 13P -8.1,-1; 14P -8.1,-3; 15P -8.1,-5; 16P -8.1,-7
DBV5 = smd 1.473 x 0.559: 1 -1.118,0.95; 2 -1.118,0; 3 -1.118,-0.95; 4 1.118,-0.95; 5 1.118,0.95
SOIC127P600X175-8N = smd 1.97 x 0.57: 1 -2.475,1.905; 2 -2.475,0.635; 3 -2.475,-0.635; 4 -2.475,-1.905; 5 2.475,-1.905; 6 2.475,-0.635; 7 2.475,0.635; 8 2.475,1.905
MAX32664 = smd 0.2 x 0.7: 32KIN 1.75,0.15; 32KOUT 1.35,0.15; DNC@6 2.95,3.05; DNC@7 2.55,3.05; SLAVE_SCL 1.35,3.05; SLAVE_SDA 1.75,3.05; VCORE 2.95,0.15; VDD@1 2.55,0.15; VDD@2 2.15,3.05; VSS@3 2.15,0.15 | smd 0.7 x 0.2: ACCEL_INT@1 3.6,2.8; DNC@1 0.7,2.4; DNC@2 0.7,1.6; DNC@3 0.7,1.2; DNC@4 3.6,1.6; DNC@5 3.6,2; HR_INT 3.6,2.4; MFIO@1 0.7,2.8; NC@1 0.7,2; NC@2 3.6,1.2; RSTN 0.7,0.8; SENSOR_SCL 3.6,0.8; SENSOR_SDA@1 3.6,0.4; VSS@1 0.7,0.4 | smd 1.4 x 1.7: EP 2.3,1.6
TST_DR_6 = drill 1.016: 1 5.08,5.969; 2 7.62,5.969; 3 10.16,5.969; 4 12.7,5.969; 5 15.24,5.969; 6 17.78,5.969; 7 5.08,3.429; 8 7.62,3.429; 9 10.16,3.429; 10 12.7,3.429; 11 15.24,3.429; 12 17.78,3.429
TPS63001 = smd 0.8 x 0.24: 1 0.1,2.7; 2 0.1,2.2; 3 0.1,1.7; 4 0.1,1.2; 5 0.1,0.7; 6 3.1,0.7; 7 3.1,1.2; 8 3.1,1.7; 9 3.1,2.2; 10 3.1,2.7 | smd 1.65 x 2.4: 11 1.6,1.7
C0805K = smd 1.3 x 1.6: A -1,0; C 1,0
BATTERY_HOLE = drill 1: 1 0,0
XTAL_ABS06-107-32.768KHZ-T = smd 0.75 x 1.4: 1 -0.73,0; 2 0.73,0

### Placement (x,y rotation side)
C1  20.45,25.27 0 bottom
C2  9.14,38.23 0 top
C3  9.27,8.89 270 bottom
C4  2.29,6.73 0 bottom
C5  7.49,26.16 0 bottom
C6  20.45,26.92 0 bottom
C7  17.91,24 90 bottom
C8  16.13,23.24 270 bottom
C9  24.89,16.76 180 bottom
C10  24.89,18.41 0 bottom
C11  56.9,24.51 0 top
C12  59.76,36.96 90 bottom
C13  57.53,19.43 180 top
C14  49.78,21.84 90 top
C15  19.94,19.68 180 bottom
C16  19.94,21.34 0 bottom
C17  38.35,11.94 0 top
C18  57.53,17.78 0 top
C19  32.77,37.97 270 top
C20  35.69,24.69 270 top
C21  29.84,24.61 270 top
C22  52.45,14.1 180 bottom
C23  1.65,19.94 90 top
C24  36.96,38.07 270 top
C25  30.86,37.97 270 top
C26  27.25,33.78 0 top
C27  11.56,40.77 270 top
C28  17.91,40.39 270 top
C29  24,37.97 270 top
C30  35.45,38.07 270 top
FB1  21.84,23.11 180 bottom
IC1  63.75,16.26 0 top
J1  69.33,28.04 90 top
J2  70.26,15.7 90 top
L1  27.56,41.02 0 top
LED1  26.16,15.49 270 top
Q1  5.21,39.12 90 top
Q2  14.22,40.51 180 top
Q3  13.46,36.45 90 top
R1  6.6,19.94 270 top
R2  26.29,17.27 0 top
R3  48.13,21.84 90 top
R4  41.8,20.19 270 top
R5  34.59,20.27 0 top
R6  41.75,15.82 270 top
R7  7.49,27.81 180 bottom
R8  7.49,24.51 0 bottom
R9  34.6,15.68 0 top
R10  6.22,8.89 90 bottom
R11  7.75,8.89 270 bottom
R12  2.29,3.43 0 bottom
R13  2.29,4.95 180 bottom
R16  23.85,33.78 180 top
R17  8.26,40.77 90 top
R18  4.06,19.94 270 top
R19  9.91,40.77 90 top
R20  19.68,40.39 90 top
R21  18.67,37.59 0 top
RESET  40.39,9.02 180 top
SV2  30.23,3.17 0 top
U1  19.56,22.99 180 top
U2  38.61,20.22 90 top
U3  55.55,35.13 0 top
U4  38.6,15.73 90 top
U6  32.77,24.59 0 top
U7  3.56,14.48 90 top
U$10  51.56,20.22 0 top
U$20  0.13,0.13 0 top
U$22  25.91,38.73 270 top
U$38  18.29,35.81 180 top
U$40  1.78,41.53 0 top
U$41  1.78,37.21 0 top
Y2  53.09,17.75 0 top

### Tracks (layer width: path | path; a pad name or v marks a point on that pad's centre or on a via)
1.8V  (via drill 0.35)
  Top 0.203: U$10.VDD@1 54.11,19.68 54.99,18.8 54.99,18.16 55.37,17.78 56.64,17.78 C18.1 | U$10.VDD@2 53.71,23.87 54.36,24.51 56.01,24.51 C11.1
  Top 0.305: 39.8,14.73 U4.1 | U2.1 40.01,19.27 | 41.73,19.27 R4.2 | 41.56,14.78 R6.2
  Top 0.406: C20.1 37.96,25.54 | 37.96,25.54 38.73,24.77 38.73,19.68 | 40.01,19.27 39.15,19.27 38.73,19.68 | 38.73,19.68 38.23,19.18 38.23,15.24 38.73,14.73 39.8,14.73 | U4.1 41.56,14.78 | U2.1 41.73,19.27 | 37.96,25.54 37.98,25.54 38.48,26.04 55.24,26.04 56.01,25.27 56.01,24.51 | J2.1 66.94,13.2 v66.93,13.21 | R6.2 43.41,14.97 v43.43,14.99 44.7,16.26 56.01,16.26 56.64,16.89 56.64,17.78
  Top 0.508: U6.5 C20.1
  Bottom 0.406: v43.43,14.99 44.07,14.35 44.07,12.57 44.7,11.94 47.24,11.94 56.26,11.94 57.53,13.21 v66.93,13.21
3.3V  (via drill 0.35)
  Top 0.203: U1.24 16.81,25.7 v16.76,25.65 | U1.36 16.59,20.24 v16.64,20.19 | v1.65,15.49 U7.8 C23.1 2.45,19.09 2.79,19.43 2.79,20.57 3.05,20.83 4.03,20.83 R18.1 R1.1 | v22.86,16.76 22.31,17.32 U1.48
  Top 0.254: U$22.10 28.61,35.02 28.93,34.7 33.3,34.7 v34.16,35.56
  Top 0.305: U6.3 31.65,22.45 32.13,21.97 33.27,21.97 33.78,21.46 33.78,20.32 R5.1 33.74,15.69 R9.1
  Top 0.406: U3.5P v61.48,36.13 v61.47,36.12 | v49.66,15.11 47.71,15.11 IC1.1 | v66.93,15.24 70.21,15.24 J2.3 | v51.56,10.92 v51.56,12.83
  Top 0.508: C21.1 28.77,25.46 v28.32,25.02
  Bottom 0.203: C7.1 17.11,23.15 16.89,23.37 16.89,24 16.76,24.13 16.26,24.13 | 16.26,24.13 16.17,24.13 C8.1 | v16.76,25.65 16.26,25.15 16.26,24.13 | C16.1 20.79,20.66 20.57,20.45 19.18,20.45 19.05,20.32 19.05,19.94 | 19.05,19.94 19.05,19.72 C15.1 | v16.64,20.19 17.65,20.19 17.91,19.94 19.05,19.94 | 1.27,9.78 0.51,9.02 0.51,3.68 0.76,3.43 R12.2 1.4,3.39 1.4,2.03 2.16,1.27 13.34,1.27 13.97,1.91 13.97,3.17 14.35,3.56 U$20.11 | 1.27,9.78 6.18,9.78 R10.2 | 1.27,9.78 0.51,10.54 0.51,12.57 1.65,13.72 v1.65,15.49 | v22.86,16.76 C9.1 24.04,17.31 24.26,17.53 25.53,17.53 25.78,17.78 25.78,18.38 C10.1
  Bottom 0.254: v34.16,35.56 34.16,39.27 v34.19,39.29
  Bottom 0.305: C10.1 25.74,19.09 25.4,19.43 23.11,19.43 21.21,21.34 C16.1
  Bottom 0.406: C12.1 59.84,36.2 59.92,36.12 | v61.47,36.12 59.92,36.12 | v42.29,39.12 53.85,39.12 56.9,36.07 59.87,36.07 59.92,36.12 | v49.66,15.11 50.67,14.1 C22.1 | C22.1 51.6,14.9 51.94,15.24 v66.93,15.24 | v51.56,10.92 51.56,6.35 50.55,5.33 46.35,5.33 43.05,2.03 36.45,2.03 SV2.5 | v51.56,12.83 51.56,14.06 C22.1
  Bottom 0.508: v28.32,25.02 28.32,18.92 27.81,18.41 | 27.81,18.41 C10.1 | 27.81,18.41 28.32,17.91 28.32,8.26 29.08,7.49 34.42,7.49 35.31,6.6 SV2.5 33.66,1.52 17.4,1.52 U$20.11
  Bottom 0.762: v41.02,39.12 41.02,28.07 40.13,27.18 32.26,27.18 v32.26,27.05
  other vias: 39.75,39.12 30.99,27.05 29.84,27.05
  pour Top (no thermals): 28.52,39.32 28.52,38.2 42.75,38.2 42.75,39.75 29.36,39.75 29.06,39.45 28.65,39.45
  pour Bottom (no thermals): 21.59,23.88 21.59,20.83 19.94,20.83 19.94,22.48 17.27,22.48 17.27,23.88
  pour Bottom: 37.59,38.2 37.59,39.75 42.75,39.75 42.75,38.2
  pour Top (no thermals): 32.89,27.69 32.89,23.5 29.21,23.5 29.21,27.69
  pour Bottom: 32.77,26.29 32.77,27.69 29.21,27.69 29.21,26.16 32.77,26.16
BO1  (via drill 0.35)
  Top 0.203: U1.3 25.75,21.24 27.18,19.81 29.08,19.81 v29.34,19.56
BO2  (via drill 0.35)
  Top 0.203: U1.2 25.62,20.74 27.18,19.18 28.7,19.18 29.34,18.54 v29.34,18.29
BTN2  (via drill 0.35)
  Top 0.203: U1.45 20.81,17.63 v20.45,17.27
  Bottom 0.203: C3.1 R11.1 7.75,15.24 8.76,16.26 14.1,16.26 15.11,17.27 v20.45,17.27
BTN2_OUT
  Bottom 0.203: R10.1 R11.2 U$20.2
BTN3  (via drill 0.35)
  Top 0.203: U1.46 21.31,16.74 v21.08,16.51 | v8.51,14.61 7.49,14.61 6.99,14.1 6.99,9.27 6.48,8.76 v5.08,8.76
  Bottom 0.203: R13.1 1.44,5.63 1.65,5.84 2.92,5.84 3.17,6.1 3.17,6.69 C4.1 3.14,8.22 3.68,8.76 v5.08,8.76 | v8.51,14.61 15.49,14.61 17.4,16.51 v21.08,16.51
BTN3_OUT
  Bottom 0.203: R13.2 R12.1 3.26,3.56 U$20.7
BTN_POWER_OUT  (via drill 0.35)
  Top 0.203: U$20.1 4.32,6.99 4.32,10.29 4.83,10.79 v4.83,14.35 | C2.1 8.29,37.12 v8,36.83 | v16.13,35.18 16.65,35.18 U$38.C
  Top 0.406: R17.1 8.29,39.88 C2.1
  Bottom 0.203: v16.13,35.18 15.88,34.92 9.91,34.92 | v4.83,14.35 4.83,21.97 5.46,22.61 7.11,22.61 7.49,22.99 7.49,33.53 8,34.04 9.02,34.04 9.91,34.92 | 9.91,34.92 v8,36.83
GND  (via drill 0.35)
  Top 0.203: C20.2 v35.69,22.61 | C21.2 29.84,22.73 30.23,22.35 v30.73,22.35
  Top 0.254: C26.2 U$22.9 28.11,36.63 U$22.11 U$22.3 | U$10.VSS@3 53.71,21.67 U$10.EP
  Top 0.305: U6.2 30.05,24.59 29.84,24.38 C21.2
  Top 0.406: v39.5,37.08 43.05,37.08 43.94,37.97 43.94,41.53 44.58,42.16 47.41,42.16 U3.9P | J2.6 68.87,18.2 v68.83,18.16 | IC1.8 52.21,4.58 | 52.21,4.58 53.21,5.59 53.21,12.7 v53.34,12.83 | 52.21,4.58 52.21,4.56 53.69,3.08 IC1.12 | v55.5,14.1 56.01,13.58 IC1.19 65.02,13.58 65.41,13.97 65.41,16.38 64.14,17.65 v60.71,17.65 | IC1.3 47.54,11.94 44.83,11.94 44.45,11.56 44.45,9.27 44.2,9.02 RESET.1
  Bottom 0.406: v53.34,12.83 53.34,14.06 | 53.34,14.06 C22.2 | v55.5,14.1 53.38,14.1 53.34,14.06
  Bottom 0.762: v38.23,37.08 v38.23,28.45
  other vias: 60.71,24.38 60.71,21.84 60.71,19.43 1.4,8.76 51.05,19.68 45.34,22.61 45.34,21.21 45.34,19.81 66.67,29.84 66.67,26.29 52.2,34.04 55.88,30.48 59.69,34.29 55.63,40.39 45.21,10.16 54.99,17.14 1.52,30.99 11.43,30.99 14.73,30.99 2.79,23.11 8.13,21.97 8.13,17.78 8.89,12.45 20.83,11.43 25.4,11.43 30.23,11.43 34.54,10.92 31.24,19.05 28.07,28.32
  pour Top (no thermals): 21.54,37.9 40.08,37.9 40.08,36.25 21.54,36.25
  pour Top (rank 4, no thermals): 0,38.61 21.54,38.61 21.54,32.87 0,32.87
  pour Bottom (rank 4): 45.21,43.69 45.21,26.92 65.66,26.92 65.66,24.38 72.01,24.38 72.01,31.75 65.66,31.75 65.66,43.69
  pour Top (rank 4): 45.21,43.69 45.21,26.92 65.66,26.92 65.66,24.38 72.01,24.38 72.01,31.75 65.66,31.75 65.66,43.69
  pour Top (rank 4): 0,31.88 44.2,31.88 44.2,25.91 64.64,25.91 64.64,23.37 65.66,23.37 65.66,20.45 75.82,20.45 75.82,10.79 65.66,10.79 65.66,0 0,0
  pour Bottom (rank 4): 0,31.88 0,0 65.66,0 65.66,10.79 75.82,10.79 75.82,20.45 65.66,20.45 65.66,23.37 64.64,23.37 64.64,25.91 44.2,25.91 44.2,31.88
  pour Bottom: 40.08,37.9 40.08,36.25 37.59,36.25 37.59,37.9
  cutout Top: 46.35,0 65.66,0 65.66,16.26 46.35,16.26
  cutout Bottom: 46.35,0 65.66,0 65.66,16.26 46.35,16.26 46.35,15.88
GPS_NRST
  Top 0.203: U1.32 14.36,22.24 13.46,21.34 13.46,17.65 17.78,13.34 47.44,13.34 IC1.2
GPS_RX
  Top 0.203: IC1.9 46.26,3.08 44.07,0.89 21.34,0.89 21.08,1.14 21.08,6.48 13.08,14.48 13.08,21.97 13.85,22.74 U1.31
GPS_TX
  Top 0.203: IC1.10 45.53,1.58 44.45,0.51 20.7,0.51 20.32,0.89 20.32,6.48 12.7,14.1 12.7,22.35 13.59,23.24 U1.30
HR_MFIO  (via drill 0.35)
  Top 0.203: U1.4 26.02,21.74 27.18,20.57 v29.34,20.57 | v46.1,23.75 50.67,23.75 51.44,22.99 52.23,22.99 U$10.MFIO@1
  Bottom 0.203: v29.34,20.57 31.24,20.57 32,21.34 35.81,21.34 38.23,23.75 v46.1,23.75
HR_RESET  (via drill 0.35)
  Top 0.203: U$10.RSTN 49.81,21.02 C14.1 49.78,18.54 48.9,17.65 v44.32,17.65 | U1.41 18.81,15.48 v19.81,14.48 | v27.3,12.57 v29.34,12.57
  Bottom 0.203: v44.32,17.65 31.24,17.65 30.48,16.89 30.48,12.95 30.1,12.57 v29.34,12.57 | v19.81,14.48 19.81,12.95 20.19,12.57 v27.3,12.57
INT
  Top 0.203: U$10.HR_INT 62.73,22.62 65.79,19.56 71.25,19.56 72.26,18.54 72.26,14.73 71.73,14.2 J2.2
LORA_CS
  Top 0.203: U1.14 21.81,28.41 22.61,29.21 45.47,29.21 45.85,28.83 49.66,28.83 50.16,29.34 50.16,33.78 49.78,34.16 47.48,34.16 U3.13P
LORA_DIO0
  Top 0.203: U1.19 19.31,29.09 22.1,31.88 44.45,31.88 45.47,32.89 45.47,34.42 45.85,34.8 53.34,34.8 56.67,38.13 U3.6P
LORA_MISO  (via drill 0.35)
  Top 0.203: U1.16 20.81,28.68 22.35,30.23 40.26,30.23 40.39,30.1 43.31,30.1 v43.56,30.35 | v44.07,32.77 44.07,35.81 45.09,36.83 48.77,36.83 49.53,37.59 49.53,39.5 48.9,40.13 U3.10P
  Bottom 0.203: v43.56,30.35 44.07,30.86 v44.07,32.77
LORA_MOSI  (via drill 0.35)
  Top 0.203: U1.17 20.31,28.82 22.23,30.73 40.39,30.73 40.64,30.48 42.22,30.48 v42.39,30.66 | v42.42,32.77 42.42,35.31 45.24,38.13 U3.11P
  Bottom 0.203: v42.39,30.66 42.39,32.74 v42.42,32.77
LORA_RESET
  Top 0.203: U1.18 19.81,28.95 22.1,31.24 44.7,31.24 45.59,32.13 U3.14P
LORA_SCK  (via drill 0.35)
  Top 0.203: U1.15 21.31,28.55 22.48,29.72 45.59,29.72 46.1,29.21 49.02,29.21 49.4,29.59 v49.4,33.4 | v49.4,35.43 49.4,35.94 49.15,36.2 47.52,36.2 U3.12P
  Bottom 0.203: v49.4,33.4 v49.4,35.43
MEASURE  (via drill 0.35)
  Top 0.203: Q1.2 6.31,39.33 6.1,39.12 5.46,39.12 5.21,38.86 v5.21,37.08
  Top 1.016: Q1.2 6.3,40.69 7.22,41.62 R17.2 R19.2 C27.1 Q2.2
  Bottom 0.203: R7.1 6.64,35.65 v5.21,37.08
N$1
  Top 0.203: R2.1 25.44,15.82 LED1.A
N$2
  pour Top (no thermals): 27.25,38.23 26.97,38.23 26.97,39.14 26.19,39.93 26.19,42.11 27.41,42.11 27.41,39.62 27.25,39.47
N$3
  pour Top (no thermals): 27.99,38.23 27.99,39.24 27.76,39.47 27.76,42.11 28.93,42.11 28.93,39.75 28.5,39.75 28.22,39.47 28.22,38.23
N$4  (via drill 0.35)
  Top 0.203: v26.92,26.92 26.92,25.15 26.52,24.74 U1.10
  Bottom 0.203: v26.92,26.92 26.04,27.81 R7.2 C5.1 R8.1
N$5  (via drill 0.35)
  Top 0.203: v22.48,24.89 22.48,24.38 22.63,24.24 U1.9
  Bottom 0.203: C1.1 22.1,25.27 v22.48,24.89 | C6.1 C1.1 | C1.1 21.3,24.68 21.84,24.13 21.84,23.37 22.1,23.11 FB1.2
N$6
  Top 0.203: U$10.VCORE 54.51,19.91 54.74,19.68 56.43,19.68 C13.2
N$7
  Top 0.254: R16.1 C26.1 26.61,33.78 U$22.6 U$22.7 U$22.8
N$8
  Top 0.508: J1.1 63.74,28.04 U3.1P
N$9
  Top 0.203: R3.2 C14.2
N$10
  Top 0.203: U$10.32KIN 53.31,19.08 53.82,18.57 Y2.2
N$11
  Top 0.203: U$10.32KOUT 52.91,19.13 52.36,18.57 Y2.1
N$12
  Top 0.203: U1.5 28.82,22.24 30.35,20.7 30.35,17.65 29.97,17.27 R2.2
N$13
  Top 0.406: C28.2 17.91,37.68 R21.1 16.51,37.59 16,37.08 16,36.07 15.43,35.5 Q3.1
N$14
  Top 0.305: Q2.1 15.17,40.65 15.01,40.49 13.23,40.49 12.65,39.9 11.57,39.9 C27.2
  Top 0.406: C27.2 R19.1 9.91,38.31 C2.2 11.25,38.23 12.36,37.12 Q3.3
NRST  (via drill 0.35)
  Top 0.203: SV2.1 25.15,8.13 26.04,9.02 RESET.2 37.5,9.1 C17.1 32.64,11.94 v32,12.57 | U1.7 27.18,23.24 27.19,23.24 28.57,23.24 30.35,21.46 30.86,21.46 32,20.32 v32,15.11
  Bottom 0.203: v32,15.11 v32,12.57
OLED_CS
  Top 0.203: U1.25 11.77,25.74 10.29,24.26 U$20.3
OLED_DC
  Top 0.203: U1.27 12.16,24.74 11.3,23.88 11.3,12.45 11.3,12.32 11.3,10.16 U$20.5
OLED_MOSI
  Top 0.203: U1.28 12.3,24.24 11.81,23.75 11.81,12.19 U$20.6
OLED_RESET
  Top 0.203: U1.29 12.56,23.74 12.32,23.5 12.32,13.72 19.43,6.6 19.43,4.06 18.92,3.56 U$20.12
OLED_SCK
  Top 0.203: U1.26 12.03,25.24 10.79,24 10.79,8.13 U$20.4
SCL_EEPROM
  Top 0.203: 4.19,19.05 5.08,19.05 5.97,19.94 8.51,19.94 9.27,20.7 9.27,28.7 10.16,29.59 17.65,29.59 18.31,28.94 U1.21 | 4.19,19.05 4.1,19.05 R18.2 | U7.6 4.19,19.05
SCL_HR
  Top 0.203: U1.42 19.31,15.87 21.34,13.84 34.67,13.84 35.45,14.62 R9.2
  Top 0.305: R9.2 37.3,15.68 U4.3
SCL_HR_1.8V
  Top 0.203: R6.1 42.83,16.67 43.18,17.02 43.18,23.88 43.94,24.64 52.32,24.64 52.91,24.05 U$10.SLAVE_SCL
  Top 0.305: U4.2 41.74,16.68 R6.1
SCL_TO_HR_SENSOR
  Top 0.203: U$10.SENSOR_SCL 62.17,21.02 66.04,17.14 70.2,17.14 J2.5
SDA_EEPROM
  Top 0.203: U7.5 5.46,18.8 5.75,19.09 R1.2 6.64,19.05 8.26,19.05 9.78,20.57 9.78,28.57 10.41,29.21 17.4,29.21 17.81,28.8 U1.22
SDA_HR
  Top 0.203: U1.43 19.81,16.01 21.46,14.35 34.29,14.35 34.59,14.66 34.59,18.19 35.44,19.03 R5.2
  Top 0.305: R5.2 37.31,20.27 U2.3
SDA_HR_1.8V
  Top 0.203: R4.1 41.8,24.15 42.8,25.15 52.45,25.15 53.31,24.29 U$10.SLAVE_SDA
  Top 0.305: U2.2 41.67,21.17 R4.1
SDA_TO_HR_SENSOR
  Top 0.203: U$10.SENSOR_SDA@1 61.93,20.62 66.35,16.2 J2.4
SHUTDOWN  (via drill 0.35)
  Top 0.203: U1.12 24.98,25.74 25.4,26.16 v25.4,28.45 | v19.3,34.54 19.3,35.8
  Top 0.254: 19.3,35.8 U$38.A
  Top 0.406: R20.1 19.68,37.76 R21.2 19.52,36.05 U$38.A
  Bottom 0.203: v25.4,28.45 25.4,32.26 24.89,32.77 21.08,32.77 v19.3,34.54
SWCLK  (via drill 0.35)
  Top 0.203: U1.37 16.81,16.59 v18.41,14.99
  Bottom 0.203: SV2.4 32.77,4.83 32,5.59 23.37,5.59 18.41,10.54 v18.41,14.99
SWDIO  (via drill 0.35)
  Top 0.203: U1.34 14.43,21.24 14.02,20.83 14.02,18.11 v17.14,14.99
  Bottom 0.203: SV2.2 27.69,4.45 27.05,5.08 23.24,5.08 18.03,10.29 18.03,13.59 18.03,13.72 18.03,14.1 v17.14,14.99
VIN_BATTERY
  Top 1.016: U$40.1 1.78,40.01 2.67,39.12 Q1.3
VIN_BB  (via drill 0.35)
  Top 0.254: R16.2 23,34.91 v22.28,35.64
  Top 1.016: Q2.3 15.16,39.41 17.14,41.4 17.84,41.4 C28.1 19.59,41.34 R20.2
  Bottom 0.254: v22.28,35.64 v22.28,39.29
  pour Top (no thermals): 21.54,39.8 25.88,39.8 26.67,39.01 26.67,38.2 21.54,38.2
  pour Top (no thermals): 21.54,39.8 20.73,40.61 19.18,40.61 19.18,41.86 20.73,41.86 20.98,41.86 22.99,39.85 22.94,39.8
WC_EEPROM
  Top 0.203: U7.7 2.92,14.86 2.67,14.61 0.89,14.61 0.51,14.99 0.51,27.43 3.05,29.97 17.91,29.97 18.81,29.07 U1.20

### Text on the board
tPlace: MARS WMD_Board v1 | Jacob Bobson / Austin Margolis / Lucas Pfeiffer / Morgan Harris